# Altium schematic sheet FPGA_U1_Manual.SchDoc
size A; Organization: Altium Limited; Address1: L3, 12a Rodborough Rd; Address2: Frenchs Forest; Address3: NSW; Address4: Australia 2086; DocumentNumber: 1; SheetNumber: 1; SheetTotal: 11
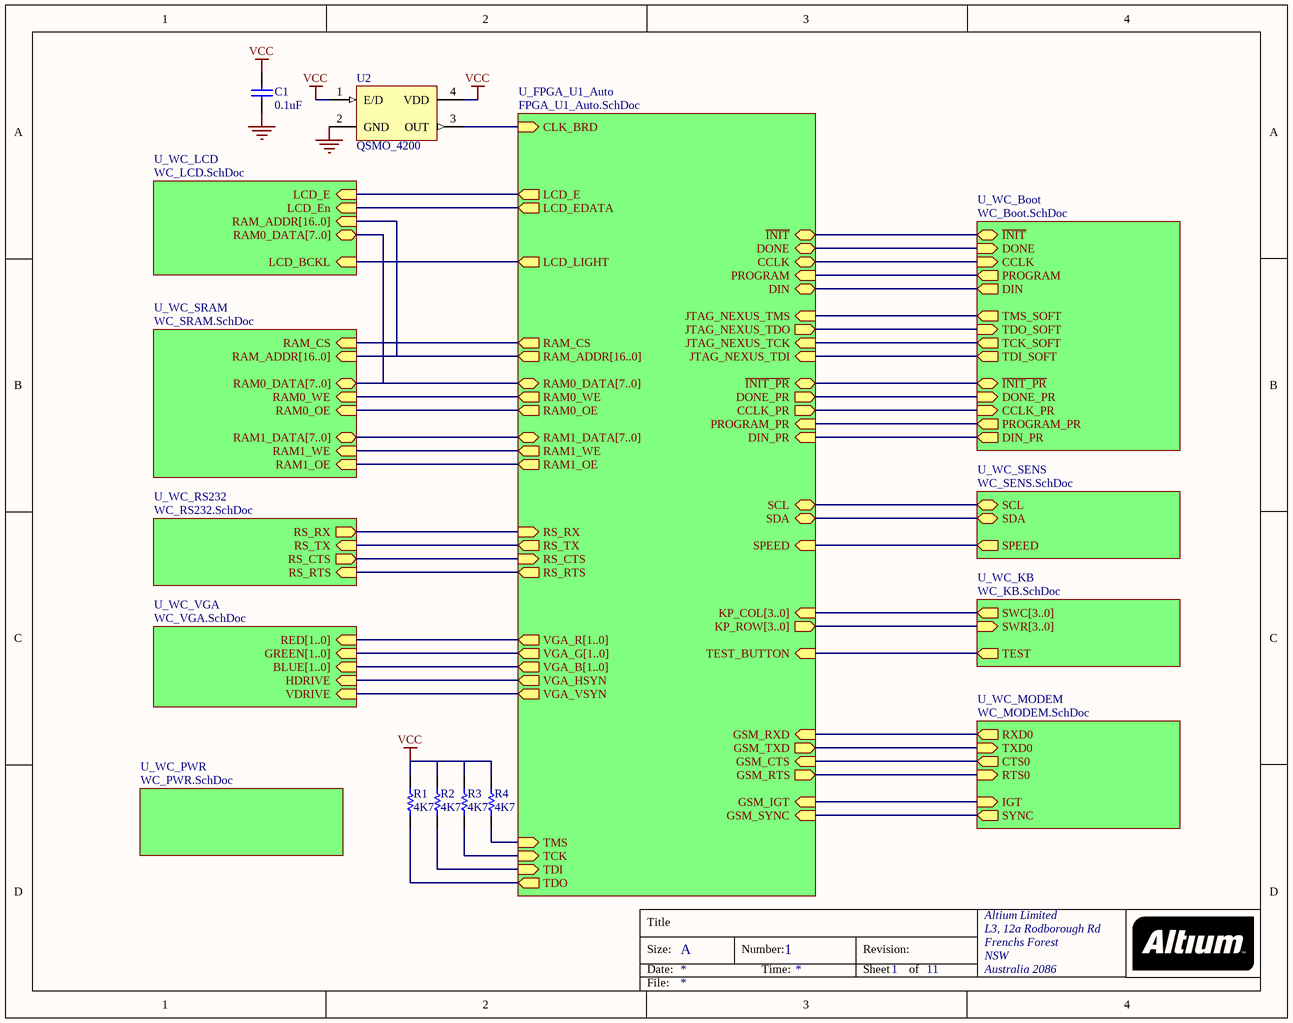
[diagram p0: FPGA_U1_Manual.SchDoc]

## Parts
C1  0.1uF  [CC2012-0805]
R1  4K7  [CC2012-0805]
R2  4K7  [CC2012-0805]
R3  4K7  [CC2012-0805]
R4  4K7  [CC2012-0805]
U2  QSMO_4200  [QSMO_4200]

## Sub-sheets
U_FPGA_U1_Auto = FPGA_U1_Auto.SchDoc: CLK_BRD (in), SPEED (in), JTAG_NEXUS_TCK (in), JTAG_NEXUS_TDI (in), JTAG_NEXUS_TDO (out), JTAG_NEXUS_TMS (in), KP_COL[3..0] (in), KP_ROW[3..0] (out), LCD_E (out), LCD_EDATA (out), LCD_LIGHT (out), RAM_ADDR[16..0] (out), RAM_CS (out), RAM0_DATA[7..0] (bidir), RAM0_OE (out), RAM0_WE (out), RAM1_DATA[7..0] (bidir), RAM1_OE (out), RAM1_WE (out), RS_CTS (in), RS_RTS (out), RS_RX (in), RS_TX (out), SCL (bidir), SDA (bidir), TEST_BUTTON (in), VGA_B[1..0] (out), VGA_G[1..0] (out), VGA_HSYN (out), VGA_R[1..0] (out), VGA_VSYN (out), CCLK (bidir), DONE (bidir), PROGRAM (in), TCK (in), TDI (in), TDO (out), TMS (in), GSM_CTS (in), GSM_IGT (in), GSM_RTS (out), GSM_RXD (in), GSM_SYNC (in), GSM_TXD (out), CCLK_PR (out), DIN_PR (in), DONE_PR (out), PROGRAM_PR (in), ~{INIT_PR} (bidir), ~{INIT} (bidir), DIN (bidir)
U_WC_Boot = WC_Boot.SchDoc: ~{INIT} (bidir), DONE (in), CCLK (in), ~{INIT_PR} (bidir), DONE_PR (in), CCLK_PR (in), DIN (out), DIN_PR (out), PROGRAM (out), PROGRAM_PR (out), TMS_SOFT (out), TDO_SOFT (in), TCK_SOFT (out), TDI_SOFT (out)
U_WC_KB = WC_KB.SchDoc: TEST (out), SWR[3..0] (in), SWC[3..0] (out)
U_WC_LCD = WC_LCD.SchDoc: LCD_E (in), LCD_BCKL (in), LCD_En (in), RAM0_DATA[7..0] (bidir), RAM_ADDR[16..0] (in)
U_WC_MODEM = WC_MODEM.SchDoc: TXD0 (in), RXD0 (out), IGT (in), RTS0 (in), CTS0 (out), SYNC (out)
U_WC_PWR = WC_PWR.SchDoc: no entries
U_WC_RS232 = WC_RS232.SchDoc: RS_RTS (in), RS_TX (in), RS_CTS (out), RS_RX (out)
U_WC_SENS = WC_SENS.SchDoc: SCL (bidir), SDA (bidir), SPEED (out)
U_WC_SRAM = WC_SRAM.SchDoc: RAM0_WE (in), RAM0_OE (in), RAM1_WE (in), RAM1_OE (in), RAM_CS (in), RAM0_DATA[7..0] (bidir), RAM1_DATA[7..0] (bidir), RAM_ADDR[16..0] (in)
U_WC_VGA = WC_VGA.SchDoc: RED[1..0] (in), GREEN[1..0] (in), BLUE[1..0] (in), HDRIVE (in), VDRIVE (in)

## Nets
GND: C1.2 U2.2(GND)
VCC: C1.1 R1.1 R2.1 R3.1 R4.1 U2.1(E/D) U2.4(VDD)
NetR1_2: R1.2 ; sheet U_FPGA_U1_Auto/TDO
NetR2_2: R2.2 ; sheet U_FPGA_U1_Auto/TDI
NetR3_2: R3.2 ; sheet U_FPGA_U1_Auto/TCK
NetR4_2: R4.2 ; sheet U_FPGA_U1_Auto/TMS
NetU2_3: U2.3(OUT) ; sheet U_FPGA_U1_Auto/CLK_BRD
(unnamed): sheet U_FPGA_U1_Auto/SPEED, sheet U_WC_SENS/SPEED
(unnamed): sheet U_FPGA_U1_Auto/JTAG_NEXUS_TCK, sheet U_WC_Boot/TCK_SOFT
(unnamed): sheet U_FPGA_U1_Auto/JTAG_NEXUS_TDI, sheet U_WC_Boot/TDI_SOFT
(unnamed): sheet U_FPGA_U1_Auto/JTAG_NEXUS_TDO, sheet U_WC_Boot/TDO_SOFT
(unnamed): sheet U_FPGA_U1_Auto/JTAG_NEXUS_TMS, sheet U_WC_Boot/TMS_SOFT
(unnamed): sheet U_FPGA_U1_Auto/LCD_E, sheet U_WC_LCD/LCD_E
(unnamed): sheet U_FPGA_U1_Auto/LCD_EDATA, sheet U_WC_LCD/LCD_En
(unnamed): sheet U_FPGA_U1_Auto/LCD_LIGHT, sheet U_WC_LCD/LCD_BCKL
(unnamed): sheet U_FPGA_U1_Auto/RAM_CS, sheet U_WC_SRAM/RAM_CS
(unnamed): sheet U_FPGA_U1_Auto/RAM0_OE, sheet U_WC_SRAM/RAM0_OE
(unnamed): sheet U_FPGA_U1_Auto/RAM0_WE, sheet U_WC_SRAM/RAM0_WE
(unnamed): sheet U_FPGA_U1_Auto/RAM1_OE, sheet U_WC_SRAM/RAM1_OE
(unnamed): sheet U_FPGA_U1_Auto/RAM1_WE, sheet U_WC_SRAM/RAM1_WE
(unnamed): sheet U_FPGA_U1_Auto/RS_CTS, sheet U_WC_RS232/RS_CTS
(unnamed): sheet U_FPGA_U1_Auto/RS_RTS, sheet U_WC_RS232/RS_RTS
(unnamed): sheet U_FPGA_U1_Auto/RS_RX, sheet U_WC_RS232/RS_RX
(unnamed): sheet U_FPGA_U1_Auto/RS_TX, sheet U_WC_RS232/RS_TX
(unnamed): sheet U_FPGA_U1_Auto/SCL, sheet U_WC_SENS/SCL
(unnamed): sheet U_FPGA_U1_Auto/SDA, sheet U_WC_SENS/SDA
(unnamed): sheet U_FPGA_U1_Auto/TEST_BUTTON, sheet U_WC_KB/TEST
(unnamed): sheet U_FPGA_U1_Auto/VGA_HSYN, sheet U_WC_VGA/HDRIVE
(unnamed): sheet U_FPGA_U1_Auto/VGA_VSYN, sheet U_WC_VGA/VDRIVE
(unnamed): sheet U_FPGA_U1_Auto/CCLK, sheet U_WC_Boot/CCLK
(unnamed): sheet U_FPGA_U1_Auto/DONE, sheet U_WC_Boot/DONE
(unnamed): sheet U_FPGA_U1_Auto/PROGRAM, sheet U_WC_Boot/PROGRAM
(unnamed): sheet U_FPGA_U1_Auto/GSM_CTS, sheet U_WC_MODEM/CTS0
(unnamed): sheet U_FPGA_U1_Auto/GSM_IGT, sheet U_WC_MODEM/IGT
(unnamed): sheet U_FPGA_U1_Auto/GSM_RTS, sheet U_WC_MODEM/RTS0
(unnamed): sheet U_FPGA_U1_Auto/GSM_RXD, sheet U_WC_MODEM/RXD0
(unnamed): sheet U_FPGA_U1_Auto/GSM_SYNC, sheet U_WC_MODEM/SYNC
(unnamed): sheet U_FPGA_U1_Auto/GSM_TXD, sheet U_WC_MODEM/TXD0
(unnamed): sheet U_FPGA_U1_Auto/CCLK_PR, sheet U_WC_Boot/CCLK_PR
(unnamed): sheet U_FPGA_U1_Auto/DIN_PR, sheet U_WC_Boot/DIN_PR
(unnamed): sheet U_FPGA_U1_Auto/DONE_PR, sheet U_WC_Boot/DONE_PR
(unnamed): sheet U_FPGA_U1_Auto/PROGRAM_PR, sheet U_WC_Boot/PROGRAM_PR
(unnamed): sheet U_FPGA_U1_Auto/~{INIT_PR}, sheet U_WC_Boot/~{INIT_PR}
(unnamed): sheet U_FPGA_U1_Auto/~{INIT}, sheet U_WC_Boot/~{INIT}
(unnamed): sheet U_FPGA_U1_Auto/DIN, sheet U_WC_Boot/DIN

## Buses and harness runs
bus sheet U_FPGA_U1_Auto/KP_COL[3..0] = sheet U_WC_KB/SWC[3..0]
bus sheet U_FPGA_U1_Auto/KP_ROW[3..0] = sheet U_WC_KB/SWR[3..0]
bus sheet U_FPGA_U1_Auto/RAM0_DATA[7..0] = sheet U_WC_LCD/RAM0_DATA[7..0] = sheet U_WC_SRAM/RAM0_DATA[7..0]
bus sheet U_FPGA_U1_Auto/RAM1_DATA[7..0] = sheet U_WC_SRAM/RAM1_DATA[7..0]
bus sheet U_FPGA_U1_Auto/RAM_ADDR[16..0] = sheet U_WC_LCD/RAM_ADDR[16..0] = sheet U_WC_SRAM/RAM_ADDR[16..0]
bus sheet U_FPGA_U1_Auto/VGA_B[1..0] = sheet U_WC_VGA/BLUE[1..0]
bus sheet U_FPGA_U1_Auto/VGA_G[1..0] = sheet U_WC_VGA/GREEN[1..0]
bus sheet U_FPGA_U1_Auto/VGA_R[1..0] = sheet U_WC_VGA/RED[1..0]

## Notes on the sheet
- Title
- Size:
- Date:
- A
- Number:
- Time:
- Revision:
- Sheet
- of
- File:

## Library data of the parts
C1 = CAP: Capacitor
R1-R4 = RES: Resistor
U2 = QSMO_4200: Surface Mount Crystal Oscillator